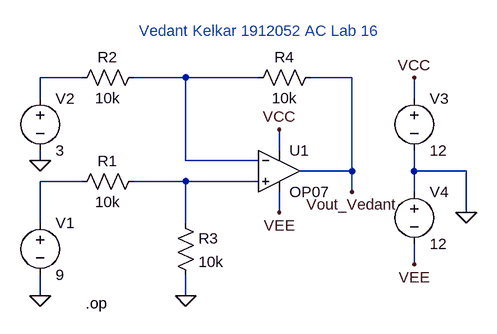
[diagram p0: schematic AC_Lab16b.asc]
AC_Lab16b.asc, the LTspice schematic file:
Version 4
SHEET 1 880 680
WIRE -80 0 -144 0
WIRE 80 0 0 0
WIRE 192 0 80 0
WIRE 336 0 272 0
WIRE -144 32 -144 0
WIRE 432 32 432 0
WIRE 224 112 224 80
WIRE -144 128 -144 112
WIRE 80 128 80 0
WIRE 192 128 80 128
WIRE 336 144 336 0
WIRE 336 144 256 144
WIRE 432 144 432 112
WIRE 512 144 432 144
WIRE -80 160 -144 160
WIRE 80 160 0 160
WIRE 192 160 80 160
WIRE 336 176 336 144
WIRE 432 176 432 144
WIRE 224 208 224 176
WIRE 512 208 512 144
WIRE -144 224 -144 160
WIRE 80 224 80 160
WIRE 432 288 432 256
WIRE -144 336 -144 304
WIRE 80 336 80 304
FLAG -144 128 0
FLAG 80 336 0
FLAG -144 336 0
FLAG 512 208 0
FLAG 336 176 Vout_Vedant
FLAG 224 80 VCC
FLAG 224 208 VEE
FLAG 432 0 VCC
FLAG 432 288 VEE
SYMBOL OpAmps\\OP07 224 80 R0
SYMATTR InstName U1
SYMBOL res 16 144 R90
WINDOW 0 0 56 VBottom 2
WINDOW 3 32 56 VTop 2
SYMATTR InstName R1
SYMATTR Value 10k
SYMBOL res 16 -16 R90
WINDOW 0 0 56 VBottom 2
WINDOW 3 32 56 VTop 2
SYMATTR InstName R2
SYMATTR Value 10k
SYMBOL voltage -144 208 R0
SYMATTR InstName V1
SYMATTR Value 9
SYMBOL res 64 208 R0
SYMATTR InstName R3
SYMATTR Value 10k
SYMBOL voltage -144 16 R0
SYMATTR InstName V2
SYMATTR Value 3
SYMBOL res 288 -16 R90
WINDOW 0 0 56 VBottom 2
WINDOW 3 32 56 VTop 2
SYMATTR InstName R4
SYMATTR Value 10k
SYMBOL voltage 432 16 R0
SYMATTR InstName V3
SYMATTR Value 12
SYMBOL voltage 432 160 R0
SYMATTR InstName V4
SYMATTR Value 12
TEXT 8 -72 Left 2 ;Vedant Kelkar 1912052 AC Lab 16
TEXT -74 348 Left 2 !.op

The netlist it stands for:
* AC_Lab16b.asc
XU1 N004 N002 VCC VEE Vout_Vedant LT1001  ; OP07, pins In+ In- V+ V- OUT
R1 N004 N003 10k
R2 N002 N001 10k
V1 N003 0 9
R3 N004 0 10k
V2 N001 0 3
R4 Vout_Vedant N002 10k
V3 VCC 0 12
V4 0 VEE 12
* Vedant Kelkar 1912052 AC Lab 16
.op
.lib LTC.lib
.backanno
.end